# Altium project 16CH_PWM_POWER_00.PrjPcb
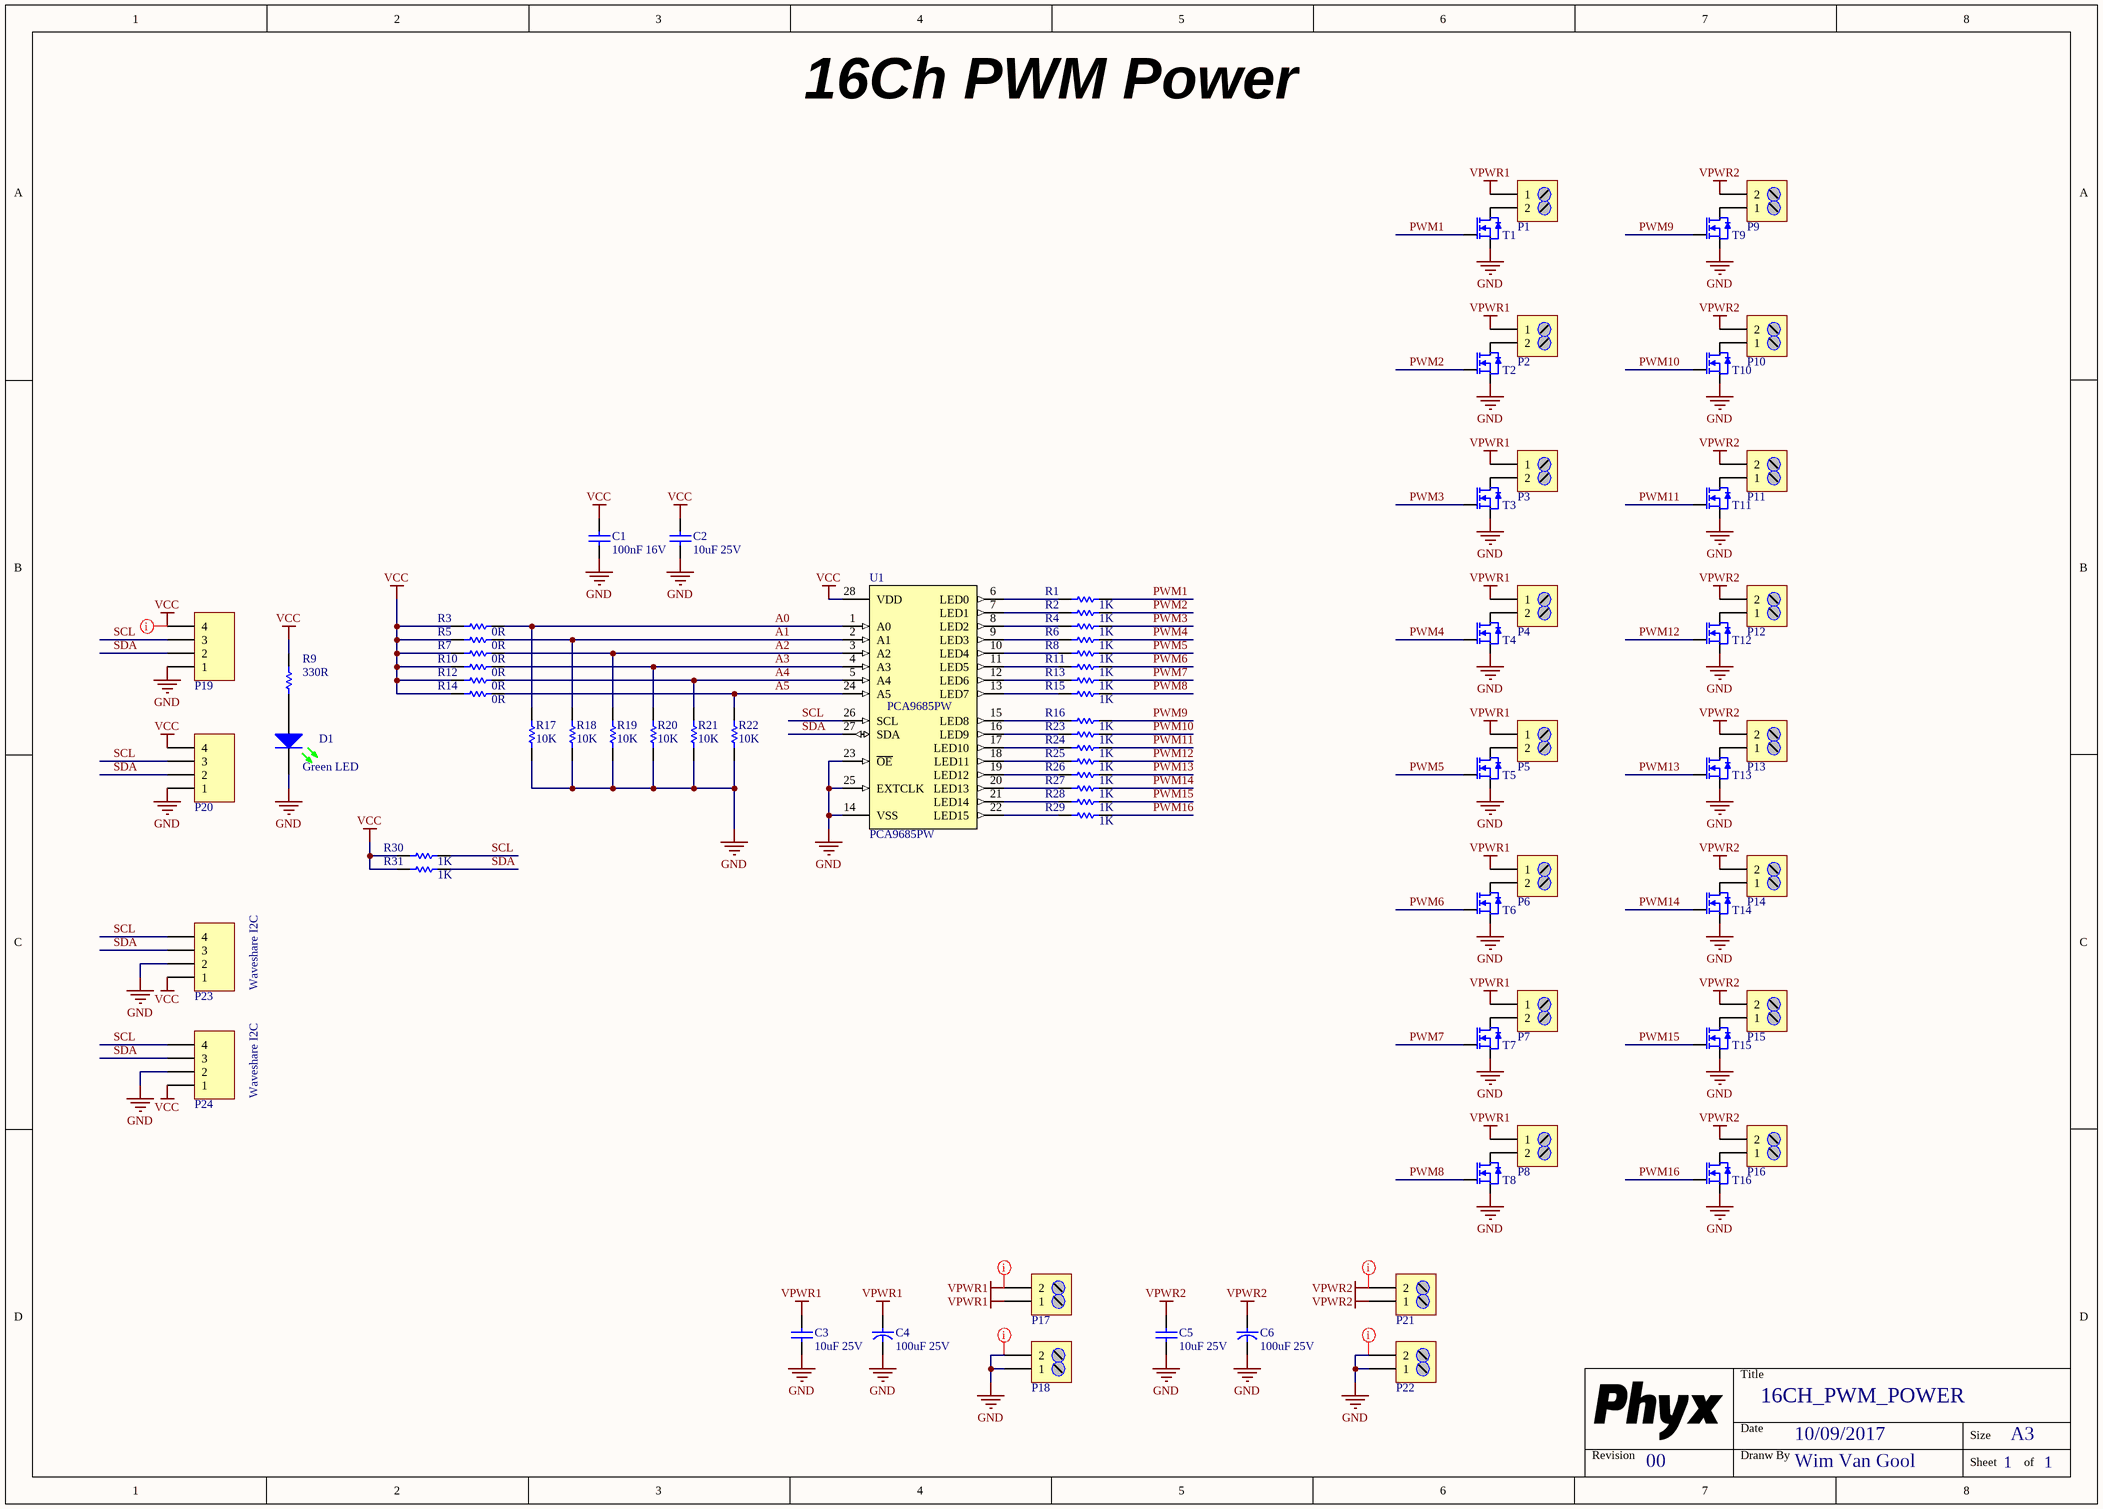
[diagram p0: 16CH_PWM_POWER_00.SchDoc]
PCB_ENGINEER: WimVG; PCB_REV: 00; PCB_TITLE: 16Ch PWM Power
1 sheet, 79 parts. Net scope: global (net labels, ports and power ports of the same name join across sheets).
Board file: 16CH_PWM_POWER_00.PcbDoc

## Sheet 16CH_PWM_POWER_00.SchDoc: 16CH_PWM_POWER
size A3; Date: 10/09/2017; DrawnBy: Wim Van Gool; Revision: 00; SheetNumber: 1; SheetTotal: 1; PageSetup: Record=PageOptions|CenterHorizontal=True|CenterVertical=True|PrintScale=0.70|XCorrection=1.00|YCorrection=1.00|PrintKind=1|BorderSize=5000000|LeftOffset=0|BottomOffset=0|Orientation=2|PaperLength=1000|PaperWidth=1000|Scale=100|PaperSource=15|PrintQuality=600|MediaType=1|DitherType=10|PrintScaleMode=1|PaperKind=A4 (210 x 297 mm)|PaperIndex=9

### Parts
C1  value 100nF 16V  [C0603_N]  (hidden comment: CAP_CERAMIC)
C2  value 10uF 25V  [C1206_N]  (hidden comment: CAP_CERAMIC)
C3  value 10uF 25V  [C1206_N]  (hidden comment: CAP_CERAMIC)
C4  value 100uF 25V  [C_8x11.5_3.5mm]  (hidden comment: CAP_POL)
C5  value 10uF 25V  [C1206_N]  (hidden comment: CAP_CERAMIC)
C6  value 100uF 25V  [C_8x11.5_3.5mm]  (hidden comment: CAP_POL)
D1  Green LED  [LED_0805_GR]
P1  2 Way Screw HDR 3,5mm  [WE_691103110002]  (value not drawn)
P2  2 Way Screw HDR 3,5mm  [WE_691103110002]  (value not drawn)
P3  2 Way Screw HDR 3,5mm  [WE_691103110002]  (value not drawn)
P4  2 Way Screw HDR 3,5mm  [WE_691103110002]  (value not drawn)
P5  2 Way Screw HDR 3,5mm  [WE_691103110002]  (value not drawn)
P6  2 Way Screw HDR 3,5mm  [WE_691103110002]  (value not drawn)
P7  2 Way Screw HDR 3,5mm  [WE_691103110002]  (value not drawn)
P8  2 Way Screw HDR 3,5mm  [WE_691103110002]  (value not drawn)
P9  2 Way Screw HDR 3,5mm  [WE_691103110002]  (value not drawn)
P10  2 Way Screw HDR 3,5mm  [WE_691103110002]  (value not drawn)
P11  2 Way Screw HDR 3,5mm  [WE_691103110002]  (value not drawn)
P12  2 Way Screw HDR 3,5mm  [WE_691103110002]  (value not drawn)
P13  2 Way Screw HDR 3,5mm  [WE_691103110002]  (value not drawn)
P14  2 Way Screw HDR 3,5mm  [WE_691103110002]  (value not drawn)
P15  2 Way Screw HDR 3,5mm  [WE_691103110002]  (value not drawn)
P16  2 Way Screw HDR 3,5mm  [WE_691103110002]  (value not drawn)
P17  2 Way Screw HDR 3,5mm  [WE_691103110002]  (value not drawn)
P18  2 Way Screw HDR 3,5mm  [WE_691103110002]  (value not drawn)
P19  Header 4  [HDR1X4]  (value not drawn)
P20  Header 4  [HDR1X4]  (value not drawn)
P21  2 Way Screw HDR 3,5mm  [WE_691103110002]  (value not drawn)
P22  2 Way Screw HDR 3,5mm  [WE_691103110002]  (value not drawn)
P23  Header 4  [HDR1X4]  (value not drawn)
P24  Header 4  [HDR1X4]  (value not drawn)
R1  value 1K  [R0603_N]  (hidden comment: RESISTOR)
R2  value 1K  [R0603_N]  (hidden comment: RESISTOR)
R3  value 0R  [R0603_N]  (hidden comment: RESISTOR)
R4  value 1K  [R0603_N]  (hidden comment: RESISTOR)
R5  value 0R  [R0603_N]  (hidden comment: RESISTOR)
R6  value 1K  [R0603_N]  (hidden comment: RESISTOR)
R7  value 0R  [R0603_N]  (hidden comment: RESISTOR)
R8  value 1K  [R0603_N]  (hidden comment: RESISTOR)
R9  value 330R  [R0603_N]  (hidden comment: RESISTOR)
R10  value 0R  [R0603_N]  (hidden comment: RESISTOR)
R11  value 1K  [R0603_N]  (hidden comment: RESISTOR)
R12  value 0R  [R0603_N]  (hidden comment: RESISTOR)
R13  value 1K  [R0603_N]  (hidden comment: RESISTOR)
R14  value 0R  [R0603_N]  (hidden comment: RESISTOR)
R15  value 1K  [R0603_N]  (hidden comment: RESISTOR)
R16  value 1K  [R0603_N]  (hidden comment: RESISTOR)
R17  value 10K  [R0603_N]  (hidden comment: RESISTOR)
R18  value 10K  [R0603_N]  (hidden comment: RESISTOR)
R19  value 10K  [R0603_N]  (hidden comment: RESISTOR)
R20  value 10K  [R0603_N]  (hidden comment: RESISTOR)
R21  value 10K  [R0603_N]  (hidden comment: RESISTOR)
R22  value 10K  [R0603_N]  (hidden comment: RESISTOR)
R23  value 1K  [R0603_N]  (hidden comment: RESISTOR)
R24  value 1K  [R0603_N]  (hidden comment: RESISTOR)
R25  value 1K  [R0603_N]  (hidden comment: RESISTOR)
R26  value 1K  [R0603_N]  (hidden comment: RESISTOR)
R27  value 1K  [R0603_N]  (hidden comment: RESISTOR)
R28  value 1K  [R0603_N]  (hidden comment: RESISTOR)
R29  value 1K  [R0603_N]  (hidden comment: RESISTOR)
R30  value 1K  [R0603_N]  (hidden comment: RESISTOR)
R31  value 1K  [R0603_N]  (hidden comment: RESISTOR)
T1  70A 30V N-Ch MOSFET Vgs 2.5  [TO-252]  (value not drawn)
T2  70A 30V N-Ch MOSFET Vgs 2.5  [TO-252]  (value not drawn)
T3  70A 30V N-Ch MOSFET Vgs 2.5  [TO-252]  (value not drawn)
T4  70A 30V N-Ch MOSFET Vgs 2.5  [TO-252]  (value not drawn)
T5  70A 30V N-Ch MOSFET Vgs 2.5  [TO-252]  (value not drawn)
T6  70A 30V N-Ch MOSFET Vgs 2.5  [TO-252]  (value not drawn)
T7  70A 30V N-Ch MOSFET Vgs 2.5  [TO-252]  (value not drawn)
T8  70A 30V N-Ch MOSFET Vgs 2.5  [TO-252]  (value not drawn)
T9  70A 30V N-Ch MOSFET Vgs 2.5  [TO-252]  (value not drawn)
T10  70A 30V N-Ch MOSFET Vgs 2.5  [TO-252]  (value not drawn)
T11  70A 30V N-Ch MOSFET Vgs 2.5  [TO-252]  (value not drawn)
T12  70A 30V N-Ch MOSFET Vgs 2.5  [TO-252]  (value not drawn)
T13  70A 30V N-Ch MOSFET Vgs 2.5  [TO-252]  (value not drawn)
T14  70A 30V N-Ch MOSFET Vgs 2.5  [TO-252]  (value not drawn)
T15  70A 30V N-Ch MOSFET Vgs 2.5  [TO-252]  (value not drawn)
T16  70A 30V N-Ch MOSFET Vgs 2.5  [TO-252]  (value not drawn)
U1  value PCA9685PW  [NXP_SOT361-1]  (hidden comment: I2C 12-bit 16Ch PWM)

### Nets
GND: C1.2 C2.2 C3.2 C4.2 C5.2 C6.2 D1.2(K) P18.1 P18.2 P19.1 P20.1 P22.1 P22.2 P23.2 P24.2 R17.2 R18.2 R19.2 R20.2 R21.2 R22.2 T1.2(S) T2.2(S) T3.2(S) T4.2(S) T5.2(S) T6.2(S) T7.2(S) T8.2(S) T9.2(S) T10.2(S) T11.2(S) T12.2(S) T13.2(S) T14.2(S) T15.2(S) T16.2(S) U1.14(VSS) U1.23(~{OE}) U1.25(EXTCLK)
VCC: C1.1 C2.1 P19.4 P20.4 P23.1 P24.1 R3.1 R5.1 R7.1 R9.1 R10.1 R12.1 R14.1 R30.2 R31.2 U1.28(VDD)
VPWR1: C3.1 C4.1 P1.1 P2.1 P3.1 P4.1 P5.1 P6.1 P7.1 P8.1 P17.1 P17.2
VPWR2: C5.1 C6.1 P9.2 P10.2 P11.2 P12.2 P13.2 P14.2 P15.2 P16.2 P21.1 P21.2
A0: R3.2 R17.1 U1.1(A0)
A1: R5.2 R18.1 U1.2(A1)
A2: R7.2 R19.1 U1.3(A2)
A3: R10.2 R20.1 U1.4(A3)
A4: R12.2 R21.1 U1.5(A4)
A5: R14.2 R22.1 U1.24(A5)
PWM1: R1.1 T1.1(G)
PWM2: R2.1 T2.1(G)
PWM3: R4.1 T3.1(G)
PWM4: R6.1 T4.1(G)
PWM5: R8.1 T5.1(G)
PWM6: R11.1 T6.1(G)
PWM7: R13.1 T7.1(G)
PWM8: R15.1 T8.1(G)
PWM9: R16.1 T9.1(G)
PWM10: R23.1 T10.1(G)
PWM11: R24.1 T11.1(G)
PWM12: R25.1 T12.1(G)
PWM13: R26.1 T13.1(G)
PWM14: R27.1 T14.1(G)
PWM15: R28.1 T15.1(G)
PWM16: R29.1 T16.1(G)
SCL: P19.3 P20.3 P23.4 P24.4 R30.1 U1.26(SCL)
SDA: P19.2 P20.2 P23.3 P24.3 R31.1 U1.27(SDA)
NetD1_1: D1.1(A) R9.2
NetP1_2: P1.2 T1.3(D)
NetP2_2: P2.2 T2.3(D)
NetP3_2: P3.2 T3.3(D)
NetP4_2: P4.2 T4.3(D)
NetP5_2: P5.2 T5.3(D)
NetP6_2: P6.2 T6.3(D)
NetP7_2: P7.2 T7.3(D)
NetP8_2: P8.2 T8.3(D)
NetP9_1: P9.1 T9.3(D)
NetP10_1: P10.1 T10.3(D)
NetP11_1: P11.1 T11.3(D)
NetP12_1: P12.1 T12.3(D)
NetP13_1: P13.1 T13.3(D)
NetP14_1: P14.1 T14.3(D)
NetP15_1: P15.1 T15.3(D)
NetP16_1: P16.1 T16.3(D)
NetR1_2: R1.2 U1.6(LED0)
NetR2_2: R2.2 U1.7(LED1)
NetR4_2: R4.2 U1.8(LED2)
NetR6_2: R6.2 U1.9(LED3)
NetR8_2: R8.2 U1.10(LED4)
NetR11_2: R11.2 U1.11(LED5)
NetR13_2: R13.2 U1.12(LED6)
NetR15_2: R15.2 U1.13(LED7)
NetR16_2: R16.2 U1.15(LED8)
NetR23_2: R23.2 U1.16(LED9)
NetR24_2: R24.2 U1.17(LED10)
NetR25_2: R25.2 U1.18(LED11)
NetR26_2: R26.2 U1.19(LED12)
NetR27_2: R27.2 U1.20(LED13)
NetR28_2: R28.2 U1.21(LED14)
NetR29_2: R29.2 U1.22(LED15)

### Layout directives
net class POWER: GND, VCC, VPWR1, VPWR2

### Notes on the sheet
- 16Ch PWM Power
- Waveshare I2C
- Title
- Revision
- Date
- Dranw By
- Size
- A3
- Sheet
- of

### Library data of the parts
C1 = CAP # 100nF 16V 0603: Capacitor Ceramic
C2 C3 C5 = CAP # 10uF 25V 1206: Capacitor Ceramic; Supplier 1: Farnell; Supplier Part Number 1: 2320887
C4 C6 = CAP 100uF 25V 8x11mm: Capacitor electrolyt; Supplier 1: Farnell; Supplier Part Number 1: 1902007
D1 = LED # Green 0805: =Description; Supplier 1: Farnell; Supplier Part Number 1: 2099239
P1-P18 P21 P22 = Terminal Block 3,5mm 2way - 691103110002: Value: 691103110002; Supplier 1: Wurth
P19 P20 P23 P24 = Pin Header 2.54mm 4way
R1 R2 R4 R6 R8 R11 R13 R15 R16 R23-R31 = RES # 1K 0603
R3 R5 R7 R10 R12 R14 = RES # 0R 0603: Supplier 1: Farnell; Supplier Part Number 1: 2447743
R9 = RES # 330R 0603
R17-R22 = RES # 10K 0603: Supplier 1: Farnell; Supplier Part Number 1: 2502397
T1-T16 = AOD210 N-Ch MOSFET 70A: Value: AOD210; Supplier 1: AliExpress
U1 = PWM # PCA9685PW: =Description; Supplier 1: Farnell; Supplier Part Number 1: 1854074

## Assembly variants
Default: not fitted P23 P24 R3 R5 R7 R10 R12 R14